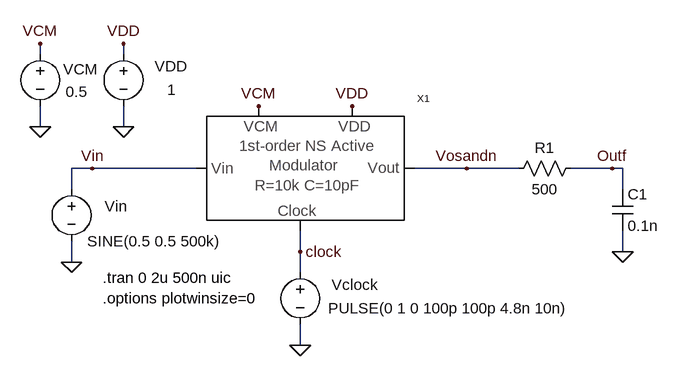
[diagram p0: schematic _Fig6_30_symbol_MSD.asc]
_Fig6_30_symbol_MSD.asc, the LTspice schematic file:
Version 4
SHEET 1 960 680
WIRE 0 -400 0 -416
WIRE 128 -400 128 -416
WIRE 0 -288 0 -320
WIRE 128 -288 128 -320
WIRE 80 -224 48 -224
WIRE 240 -224 80 -224
WIRE 656 -224 576 -224
WIRE 736 -224 656 -224
WIRE 880 -224 816 -224
WIRE 896 -224 880 -224
WIRE 48 -192 48 -224
WIRE 896 -192 896 -224
WIRE 400 -96 400 -128
WIRE 896 -96 896 -128
WIRE 48 -80 48 -112
WIRE 400 -64 400 -96
WIRE 400 48 400 16
FLAG 128 -288 0
FLAG 480 -320 VDD
FLAG 128 -416 VDD
FLAG 400 48 0
FLAG 400 -96 clock
FLAG 0 -288 0
FLAG 0 -416 VCM
FLAG 656 -224 Vosandn
FLAG 48 -80 0
FLAG 80 -224 Vin
FLAG 336 -320 VCM
FLAG 896 -96 0
FLAG 880 -224 Outf
SYMBOL voltage 128 -416 R0
WINDOW 0 48 35 Left 0
WINDOW 3 67 71 Left 0
SYMATTR InstName VDD
SYMATTR Value 1
SYMBOL voltage 400 -80 R0
WINDOW 0 48 35 Left 0
WINDOW 3 43 71 Left 0
WINDOW 123 0 0 Left 0
WINDOW 39 0 0 Left 0
SYMATTR InstName Vclock
SYMATTR Value PULSE(0 1 0 100p 100p 4.8n 10n)
SYMBOL voltage 0 -416 R0
WINDOW 0 35 39 Left 0
WINDOW 3 39 74 Left 0
SYMATTR InstName VCM
SYMATTR Value 0.5
SYMBOL voltage 48 -208 R0
WINDOW 0 51 42 Left 0
WINDOW 123 0 0 Left 0
WINDOW 39 0 0 Left 0
SYMATTR InstName Vin
SYMATTR Value SINE(0.5 0.5 500k)
SYMBOL 1_bit_1st_ANS_mod_MSD 256 -144 R0
SYMATTR InstName X1
SYMBOL res 832 -240 R90
WINDOW 0 0 56 VBottom 0
WINDOW 3 32 56 VTop 0
SYMATTR InstName R1
SYMATTR Value 500
SYMBOL cap 880 -192 R0
SYMATTR InstName C1
SYMATTR Value 0.1n
TEXT 96 -56 Left 0 !.tran 0 2u 500n uic
TEXT 96 -24 Left 0 !.options plotwinsize=0

The netlist it stands for:
* _Fig6_30_symbol_MSD.asc
VDD VDD 0 1
Vclock clock 0 PULSE(0 1 0 100p 100p 4.8n 10n)
VCM VCM 0 0.5
Vin Vin 0 SINE(0.5 0.5 500k)
XX1 Vin VDD Vosandn clock VCM 1_bit_1st_ANS_mod_MSD  ; pins Vin VDD Vout Clock VCM
R1 Outf Vosandn 500
C1 Outf 0 0.1n
.tran 0 2u 500n uic
.options plotwinsize=0
.backanno
.end